# EAGLE design Vis (EAGLE 7.3.0)
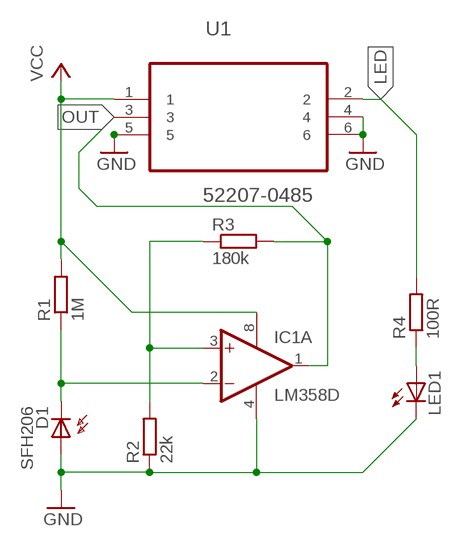
[diagram p0: schematic, sheet 1]

## Parts
D1  SFH206  [SFH206]
IC1  LM358D  [SO08]
LED1  LED5MM  [LED5MM]
R1  1M  R-EU_R1206  [R1206]
R2  22k  R-EU_R1206  [R1206]
R3  180k  R-EU_R1206  [R1206]
R4  100R  R-EU_R1206  [R1206]
U1  52207-0485  [MOLEX_52207-0485]

## Nets
GND: D1.A IC1.4(P:V-) LED1.K(C) R2.1 U1.4 U1.5 U1.6
LED: R4.2 U1.2
N$1: D1.K(C) IC1.2(A:-IN) R1.1
N$2: LED1.A R4.1
N$3: IC1.3(A:+IN) R2.2 R3.1
OUT: IC1.1(A:OUT) R3.2 U1.3
VCC: IC1.8(P:V+) R1.2 U1.1
Unconnected: IC1.5(B:+IN) IC1.6(B:-IN) IC1.7(B:OUT)

## Library data of the parts
D1 = opto-trans-siemens:SFH206: PHOTO DIODE; MF: OSRAM; MPN: SFH206K; OC_FARNELL: 1212741; OC_NEWARK: 01M8807
IC1 = linear:LM358: OP AMP also LM158; LM258; LM2904 Source: http://cache.national.com/ds/LM/LM158.pdf; MF: TEXAS INSTRUMENTS; MPN: LM358DR; OC_FARNELL: 1648685
LED1 = adafruit:LED: LED OSRAM: - CHIPLED LG R971, LG N971, LY N971, LG Q971, LY Q971, LO R971, LY R971 LH N974, LH R974 LS Q976, LO Q976, LY Q976 LO Q996 - Hyper CHIPLED LW Q18S LB Q993, LB Q99A, LB R99A - SideLED LS A670, LO A670, LY A670, LG A670, LP A670 LB A673, LV A673, LT A673, LW A673 LH A674 LY A675 LS A676, LA A676, LO A676, LY A676, LW A676 LS A679, LY A679, LG A679 - Hyper Micro SIDELED® LS Y876, LA Y876, LO Y876, LY Y876 LT Y87S - SmartLED LW L88C, LW L88S LB L89C, LB L89S, LG L890 LS L89K, LO L89K, LY L89K LS L896, LA L896, LO L896, LY L896 - TOPLED LS T670, LO T670, LY T670, LG T670, LP T670 LSG T670, LSP T670, LSY T670, LOP T670, LYG T670 LG T671, LOG T671, LSG T671 LB T673, LV T673, LT T673, LW T673 LH T674 LS T676, LA T676, LO T676, LY T676, LB T676, LH T676, LSB T676, LW T676 LB T67C, LV T67C, LT T67C, LS T67K, LO T67K, LY T67K, LW E67C LS E67B, LA E67B, LO E67B, LY E67B, LB E67C, LV E67C, LT E67C LW T67C LS T679, LY T679, LG T679 LS T770, LO T770, LY T770, LG T770, LP T770 LB T773, LV T773, LT T773, LW T773 LH T774 LS E675, LA E675, LY E675, LS T675 LS T776, LA T776, LO T776, LY T776, LB T776 LHGB T686 LT T68C, LB T68C - Hyper Mini TOPLED® LB M676 - Mini TOPLED Santana® LG M470 LS M47K, LO M47K, LY M47K Source: http://www.osram.convergy.de/; MF: WURTH ELEKTRONIK; MPN: 151053GS03000; OC_FARNELL: 2322123
R1 R2 = rcl:R-EU_: RESISTOR, European symbol; OC_FARNELL: unknown
R3 = rcl:R-EU_: RESISTOR, European symbol; MF: TE CONNECTIVITY; MPN: CRGH1206F180K; OC_FARNELL: 2332170
R4 = rcl:R-EU_: RESISTOR, European symbol
U1 = Molex_By_element14_Batch_1:52207-0485: SOCKET FPC, SMT, 1MM, 4 WAY; MPN: 52207-0485; OC_FARNELL: 1463013; OC_NEWARK: 58J9499; PACKAGE: SOCKET FPC, SMT, 1MM, 4 WAY; SUPPLIER: Molex

## Board
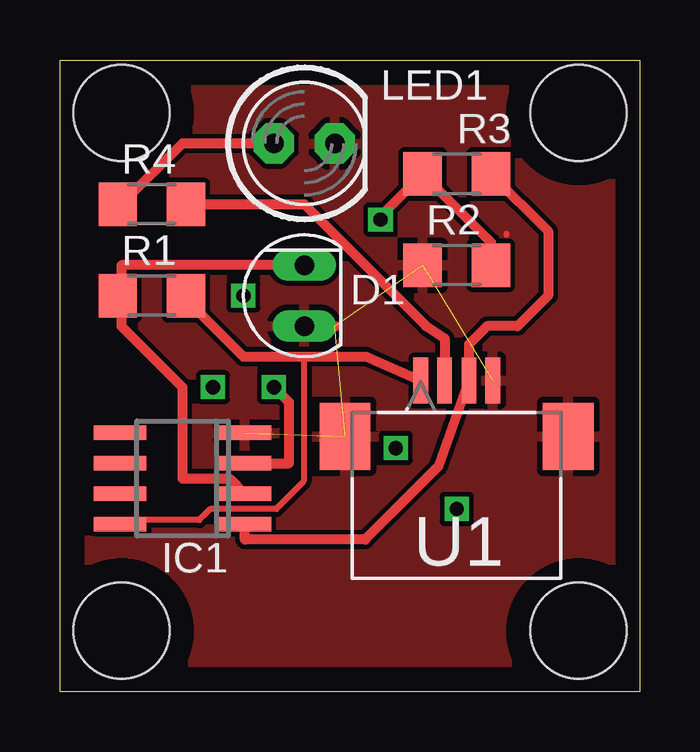
[diagram p1: board, top side]
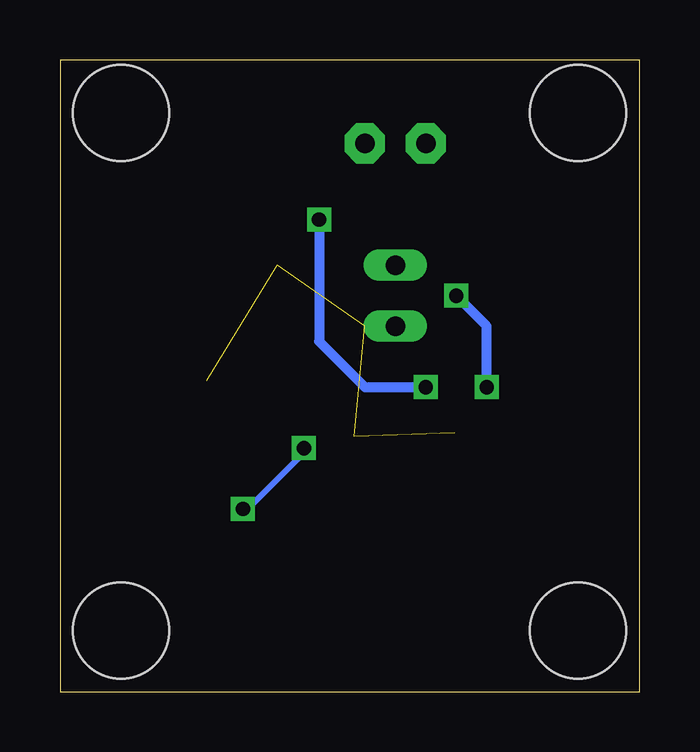
[diagram p2: board, bottom side, seen from below]

Size 24.15 x 26.34 mm. Coordinates in mm from the lower left corner, seen from the top.
Outline: 24.15,0 0,0 0,26.34 24.15,26.34 24.15,0
Copper layers (1*16): Top 0.035mm / dielectric 1.5mm / Bottom 0.035mm
Design rules "default": minimum track width 10mil, minimum drill 24mil, track to track 8mil, track to pad 8mil, pad to pad 8mil, via to via 8mil, smd to smd 8mil, copper to edge 40mil, drill to drill 8mil, minimum pad ring 10mil, minimum via ring 8mil, stop-mask expansion 4mil, vias tented up to drill 0mil, thermal gap 10mil
Holes 4 mm at 2.56,2.54 21.61,2.54 21.61,24.13 2.56,24.13

### Footprints (pad centres in the part's own frame; a part is rotated, then mirrored left to right if it is on the bottom)
SFH206 = drill 0.813 long: A 0,-1.27; K 0,1.27
SO08 = smd 0.6 x 2.2: 1 -1.905,-2.6; 2 -0.635,-2.6; 3 0.635,-2.6; 4 1.905,-2.6; 5 1.905,2.6; 6 0.635,2.6; 7 -0.635,2.6; 8 -1.905,2.6
LED5MM = drill 0.813 pad 1.676 octagon: A -1.27,0; K 1.27,0
R1206 = smd 1.6 x 1.803: 1 -1.422,0; 2 1.422,0
MOLEX_52207-0485 = smd 0.61 x 1.905: 1 1.499,4.801; 2 0.508,4.801; 3 -0.508,4.801; 4 -1.499,4.801 | smd 2.108 x 2.794: 5 -4.648,7.137; 6 4.648,7.137

### Placement (x,y rotation side)
D1  10.18,16.51 0 top
IC1  5.1,8.89 90 top
LED1  10.18,22.86 0 top
R1  3.83,16.51 0 top
R2  16.53,17.78 0 top
R3  16.53,21.59 0 top
R4  3.83,20.32 0 top
U1  16.53,17.78 180 top

### Tracks (layer width: path | path; a pad name or v marks a point on that pad's centre or on a via)
GND  (4 unrouted)
  Top 0.254: 18.61,19.05 18.61,19.09
  Top 0.406: D1.A 11.45,15.24
  pour Top: 0.02,26.67 24.15,26.67 24.15,0 -1.25,0 -1.25,26.67
LED
  Top 0.406: R4.2 10.18,20.32 15.26,15.24 16.02,14.73 U1.2
N$1
  Top 0.254: R1.1 2.38,16.53 2.56,16.53
  Top 0.406: D1.K 2.56,17.78 2.56,16.53 2.56,15.24 5.1,12.7 5.1,8.89 7.07,8.89 IC1.2
N$2
  Top 0.406: LED1.A 5.1,22.86 2.56,20.32 R4.1
N$3  (via drill 0.6)
  Top 0.406: R2.2 17.95,18.75 R3.1 13.36,19.84 v13.36,19.68 | IC1.3 9.55,9.53 9.55,12.06 v8.91,12.7
  Bottom 0.406: v13.36,19.68 13.36,14.6 11.45,12.7 v8.91,12.7
N$4  (via drill 0.6)
  Bottom 0.406: v6.37,12.7 6.37,15.24 v7.64,16.51
N$5  (via drill 0.6)
  Bottom 0.254: v16.53,7.62 16.33,7.62 13.81,10.13 v13.99,10.16
OUT
  Top 0.406: R3.2 20.34,19.2 20.34,16.51 19.07,15.24 17.8,15.24 17.04,14.48 U1.3 15.77,9.4 12.72,6.35 7.7,6.35 IC1.1
VCC
  Top 0.254: 10.16,13.97 10.16,8.76 9.01,7.62 6.27,7.62 5.81,7.16 2.61,7.16 IC1.8
  Top 0.406: R1.2 5.25,16.36 7.64,13.97 10.16,13.97 12.77,13.97 U1.1